# Altium project foxbms2-master.PrjPcb (part 4 of 8)

## Sheet rtc.SchDoc
size A3; DocumentNumber: 37; SheetNumber: 37; SheetTotal: 45; SheetDescription: Real Time Clock
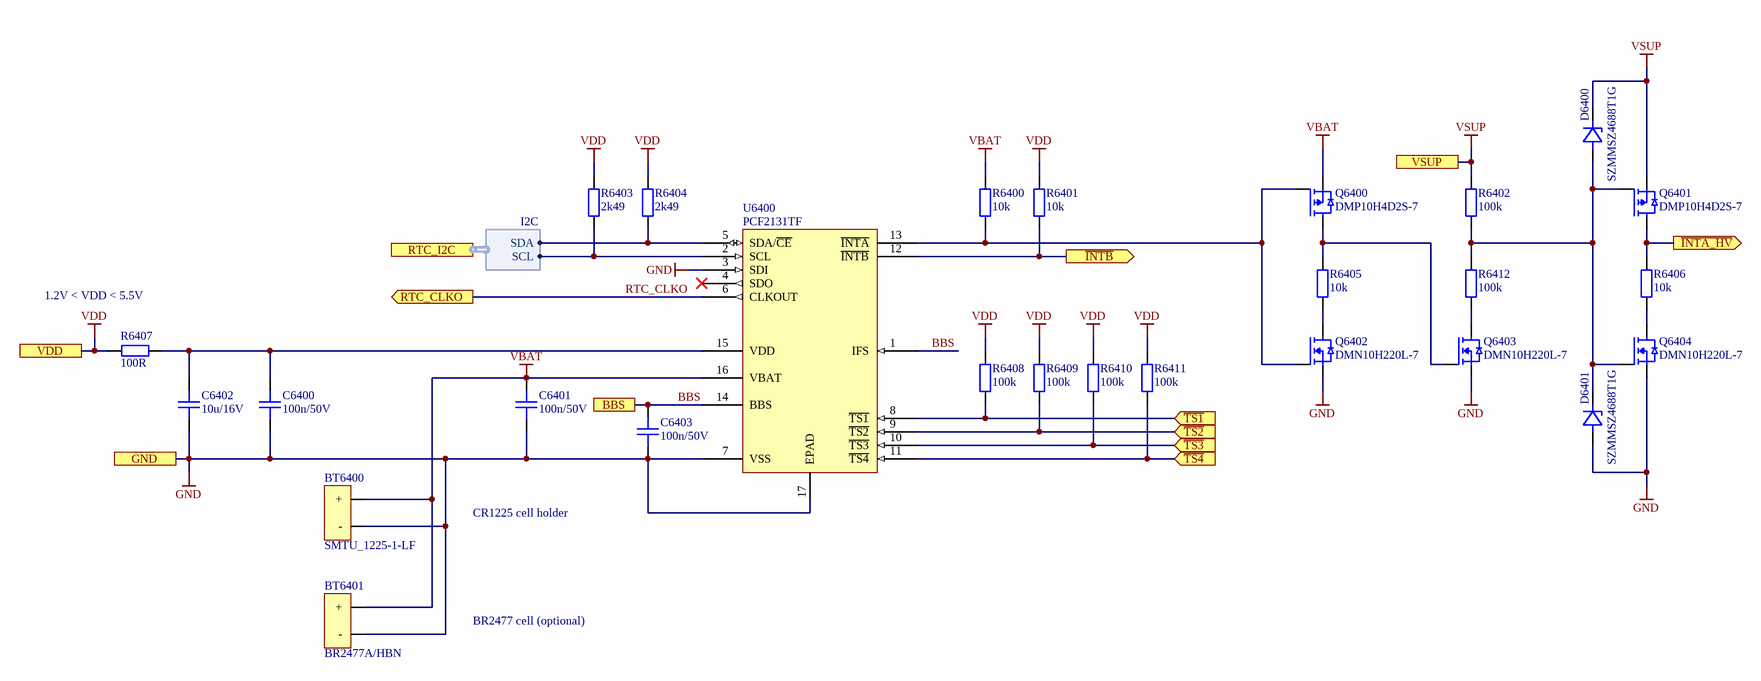
[diagram p27: rtc.SchDoc]

### Parts
BT6400  SMTU_1225-1-LF  [SMTU_1225-1-LF]
BT6401  BR2477A/HBN  [BR2477A-HBN]
C6400  100n/50V  [CAPC1005X06N]
C6401  100n/50V  [CAPC1005X06N]
C6402  10u/16V  [CAPC2012X14N]
C6403  100n/50V  [CAPC1005X06N]
D6400  SZMMSZ4688T1G  [SOD-123_CASE-425-04-ISSUE-G]
D6401  SZMMSZ4688T1G  [SOD-123_CASE-425-04-ISSUE-G]
Q6400  DMP10H4D2S-7  [SOT95P237X110-3N]
Q6401  DMP10H4D2S-7  [SOT95P237X110-3N]
Q6402  DMN10H220L-7  [SOT95P237X110-3N]
Q6403  DMN10H220L-7  [SOT95P237X110-3N]
Q6404  DMN10H220L-7  [SOT95P237X110-3N]
R6400  10k  [RESC1005X04N]
R6401  10k  [RESC1005X04N]
R6402  100k  [RESC1005X04N]
R6403  2k49  [RESC1005X04N]
R6404  2k49  [RESC1005X04N]
R6405  10k  [RESC1005X04N]
R6406  10k  [RESC1005X04N]
R6407  100R  [RESC1005X04N]
R6408  100k  [RESC1005X04N]
R6409  100k  [RESC1005X04N]
R6410  100k  [RESC1005X04N]
R6411  100k  [RESC1005X04N]
R6412  100k  [RESC1005X04N]
U6400  PCF2131TF  [NXP_SOT1992-1]

### Ports
BBS, GND, RTC_CLKO (out), RTC_I2C (harness I2C), VDD, VSUP, ~{INTA_HV} (out), ~{INTB} (out), ~{TS1} (in), ~{TS2} (in), ~{TS3} (in), ~{TS4} (in)

### Harnesses
I2C: SDA, SCL

### Nets
GND: BT6400.- BT6401.- C6400.1 C6401.1 C6402.1 C6403.1 D6401.2(A) Q6402.S Q6403.S Q6404.S U6400.3(SDI) U6400.7(VSS) U6400.17(EPAD) ; port GND
VBAT: BT6400.+ BT6401.+ C6401.2 Q6400.S R6400.2 U6400.16(VBAT)
VDD: R6401.2 R6403.2 R6404.2 R6407.2 R6408.2 R6409.2 R6410.2 R6411.2 ; port VDD  [project net MCU_3.3V]
VSUP: D6400.1(K) Q6401.S R6402.2 ; port VSUP  [project net VSUP_30]
BBS: C6403.2 U6400.1(IFS) U6400.14(BBS) ; port BBS
MCU_GIOB.1: R6401.1 U6400.12(~{INTB}) ; port ~{INTB}
MCU_GIOX.D11: R6410.1 U6400.10(~{TS3}) ; port ~{TS3}
MCU_GIOX.D12: R6409.1 U6400.9(~{TS2}) ; port ~{TS2}
MCU_GIOX.D13: R6408.1 U6400.8(~{TS1}) ; port ~{TS1}
MCU_GIOX.K16: R6411.1 U6400.11(~{TS4}) ; port ~{TS4}
MCU_I2C1.SCL: R6403.1 U6400.2(SCL) ; port RTC_I2C.SCL
MCU_I2C1.SDA: R6404.1 U6400.5(SDA/~{CE}) ; port RTC_I2C.SDA
PER_IO~{.}RTC_INTA_HV: Q6401.D R6406.2 ; port ~{INTA_HV}
RTC_CLKO: U6400.6(CLKOUT) ; port RTC_CLKO  [project net MCU_DCC.2]
NetC6400_2: C6400.2 C6402.2 R6407.1 U6400.15(VDD)
NetD6400_2: D6400.2(A) D6401.1(K) Q6401.G Q6404.G R6402.1 R6412.2
NetQ6400_D: Q6400.D Q6403.G R6405.2
NetQ6400_G: Q6400.G Q6402.G R6400.1 U6400.13(~{INTA})
NetQ6402_D: Q6402.D R6405.1
NetQ6403_D: Q6403.D R6412.1
NetQ6404_D: Q6404.D R6406.1

Not connected (* = marked no-connect by the designer): U6400 4(SDO)*

### Notes on the sheet
- (near R6407) 1.2V < VDD < 5.5V
- CR1225 cell holder
- BR2477 cell (optional)
- Fraunhofer IISB
- Schottkystr. 10
- developed by:
- 91058 Erlangen
- Germany
- Author
- Project
- License
- Description
- File
- Version
- Release Date
- Sheet
- foxbms.org <https://foxbms.org>
- www.iisb.fraunhofer.de <https://www.iisb.fraunhofer.de/>
- foxBMS Team
- /

### Library data of the parts
BT6400 = SMTU_1225-1-LF: SMTU 1225-1-LF, Battery Holder 1225; Manufacturer: Renata; Automotive Qualified: False; Part Number: SMTU_1225-1-LF; Part Name: SMTU_1225-1-LF; Operating Temperature: - / -40°C - +100°C; ComponentLink1Description: Datasheet; ComponentLink1URL: http://www.farnell.com/datasheets/1766152.pdf; Supplier 1: Farnell; Supplier Part Number 1: 1216353
BT6401 = BR2477A/HBN: Coin Cell Battery 3V 1000mAH HI TEMP; Manufacturer: Panasonic; Automotive Qualified: False; Part Number: BR2477A/HBN; Part Name: BR2477A/HBN; Operating Temperature: −40°C - +125°C; ComponentLink1Description: Datasheet; ComponentLink1URL: https://www.mouser.de/datasheet/2/315/panasonic-lithium-coin-hightemp-br2477a-datasheet-911159.pdf; Supplier 1: Digikey; Supplier Part Number 1: P029-ND; Supplier 2: Mouser; Supplier Part Number 2: 658-BR-2477A-HBN
C6400 C6401 C6403 = gen_C_ceramic_100n_50V_X7R_0402: MLCC; Capacitance: 100n; Rated Voltage: 50V; Dielectric: X7R; Case EIA: 0402; Case Metric: 1005; PnP Package: 0402C; PnP Value: 100nF/50V/X7R; PnP equipped: x; Automotive Qualified: True; AEC-Q Norm: AEC-Q200; Part Number: gen_C_ceramic_100n_50V_X7R_0402; Supplier 1: Farnell; Supplier Part Number 1: 2210822; ECCN: EAR99
C6402 = gen_C_ceramic_10u_16V_X7R_0805: MLCC; Capacitance: 10u; Rated Voltage: 16V; Dielectric: X7S; Case EIA: 0805; Case Metric: 2012; Automotive Qualified: True; AEC-Q Grade: Grade 1; AEC-Q Norm: AEC-Q200; Part Number: gen_C_ceramic_10u_16V_X7R_0805; ECCN: EAR99; Supplier 1: Digikey; Supplier Part Number 1: 445-16110-1-ND
D6400 D6401 = SZMMSZ4688T1G: Zener Diode; Manufacturer: ON Semiconductor; Breakdown Voltage: 4.7V; PnP Package: SOD123; Automotive Qualified: True; Part Number: SZMMSZ4688T1G; Part Name: SZMMSZ4688T1G; Operating Temperature: -55°C - +150°C; ComponentLink1Description: Datasheet; ComponentLink1URL: https://www.onsemi.com/pub/Collateral/MMSZ4678T1-D.PDF; Supplier 1: Digikey; Supplier Part Number 1: SZMMSZ4688T1GOSCT-ND; Supplier 2: Farnell; Supplier Part Number 2: 2774579; Supplier 3: Mouser; Supplier Part Number 3: 863-SZMMSZ4688T1G
Q6400 Q6401 = DMP10H4D2S-7: MOSFET-Transistor, p-Kanal, 0.27 A, 100 V, 4.2 ohm; Manufacturer: Diodes; Maximum Drain-Source Voltage: 100V; Maximum Continous Drain Current (25°C): 0.27A; R_DS(on): 4.2; Total Gate Charge: 1.8nC; Automotive Qualified: True; Part Number: DMP10H4D2S-7; Part Name: PMOS; Operating Temperature: -55°C - +150°C; ComponentLink1Description: Datasheet; ComponentLink1URL: https://www.diodes.com/assets/Datasheets/DMP10H4D2S.pdf; Supplier 1: Farnell; Supplier Part Number 1: 3127354; Supplier 2: Digikey; Supplier Part Number 2: DMP10H4D2S-7DICT-ND; Supplier 3: Mouser; Supplier Part Number 3: 621-DMP10H4D2S-7
Q6402-Q6404 = DMN10H220L-7: MOSFET-Transistor, n-Kanal, 1.6 A, 100 V, 0.250 ohm; Manufacturer: Diodes; Maximum Drain-Source Voltage: 100V; Maximum Continous Drain Current (25°C): 1.6A; R_DS(on): 250m; Total Gate Charge: 4.1nC; Automotive Qualified: True; Part Number: DMN10H220L-7; Part Name: NMOS; Operating Temperature: -55°C - +150°C; ComponentLink1Description: Datasheet; ComponentLink1URL: https://www.diodes.com/assets/Datasheets/DMN10H220L.pdf; Supplier 1: Digikey; Supplier Part Number 1: DMN10H220L-7DICT-ND; Supplier 2: Farnell; Supplier 3: Mouser; Supplier Part Number 2: 3127326; Supplier Part Number 3: 621-DMN10H220L-7
R6400 R6401 R6405 R6406 = gen_R_10k_0402: SMD Resistor 10k 0402; Tolerance: 1%; Power: 0.063W; Case EIA: 0402; Case Metric: 1005; Maximum Working Voltage: 50V; PnP Package: 0402R; PnP equipped: x; Automotive Qualified: True; AEC-Q Norm: AEC-Q200; Part Number: gen_R_10k_0402; Operating Temperature: -55°C - +155°C; Resistance: 10k; Series: E24, E96; PnP Value: 10k; Supplier 1: Farnell; Supplier Part Number 1: 2059239; ECCN: EAR99
R6402 R6408-R6412 = gen_R_100k_0402: SMD Resistor 100k 0402; Tolerance: 1%; Power: 0.063W; Case EIA: 0402; Case Metric: 1005; Maximum Working Voltage: 50V; PnP Package: 0402R; PnP equipped: x; Automotive Qualified: True; Part Number: gen_R_100k_0402; Operating Temperature: -55°C - +155°C; Resistance: 100k; Series: E24, E96; PnP Value: 100k; Supplier 1: Farnell; Supplier Part Number 1: 2302839
R6403 R6404 = gen_R_2k49_0402: SMD Resistor 2k49 0402; Tolerance: 1%; Power: 0.063W; Case EIA: 0402; Case Metric: 1005; Maximum Working Voltage: 50V; PnP Package: 0402R; Automotive Qualified: True; Part Number: gen_R_2k49_0402; Operating Temperature: -55°C - +155°C; Resistance: 2k49; Series: E96; PnP Value: 2k49; Supplier 1: Farnell; Supplier Part Number 1: 2059135
R6407 = gen_R_100R_0402: SMD Resistor 100R 0402; Tolerance: 1%; Power: 0.063W; Case EIA: 0402; Case Metric: 1005; Maximum Working Voltage: 50V; PnP Package: 0402R; PnP equipped: x; Automotive Qualified: True; AEC-Q Norm: AEC-Q200; Part Number: gen_R_100R_0402; Operating Temperature: -55°C - +155°C; Resistance: 100R; Series: E24, E96; PnP Value: 100R; Supplier 1: Farnell; Supplier Part Number 1: 2302528; ECCN: EAR99
U6400 = PCF2131TF: Ultra low power and high accurate RTC with integrated quartz crystal; Manufacturer: NXP; Automotive Qualified: True; AEC-Q Norm: AEC-Q100; Part Number: PCF2131TF; Part Name: PCF2131TF; Operating Temperature: −40°C - +85°C; ComponentLink1Description: Datasheet; ComponentLink1URL: https://www.nxp.com/docs/en/data-sheet/PCF2131DS.pdf

## Sheet port-expanders.SchDoc
size A3; DocumentNumber: 35; SheetNumber: 35; SheetTotal: 45; SheetDescription: Port Expanders for Digital IOs
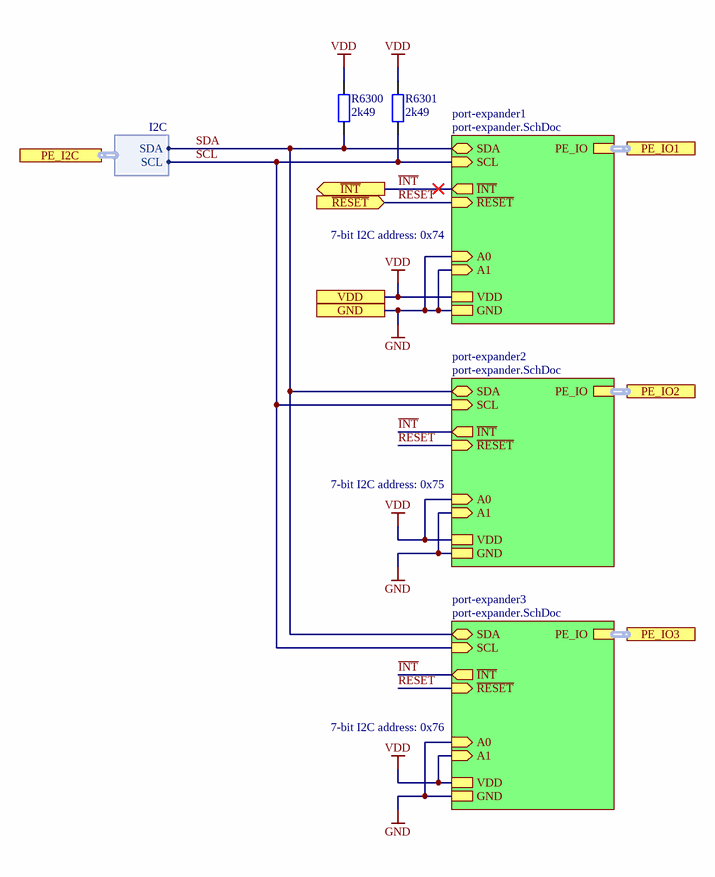
[diagram p28: port-expanders.SchDoc]

### Parts
R6300  2k49  [RESC1005X04N]
R6301  2k49  [RESC1005X04N]

### Sub-sheets
port-expander1 = port-expander.SchDoc: GND, A1 (in), A0 (in), ~{RESET} (in), VDD, SDA (bidir), ~{INT} (out), SCL (in), PE_IO (harness PE_IO)
port-expander2 = port-expander.SchDoc: GND, A1 (in), A0 (in), ~{RESET} (in), VDD, SDA (bidir), ~{INT} (out), SCL (in), PE_IO (harness PE_IO)
port-expander3 = port-expander.SchDoc: GND, A1 (in), A0 (in), ~{RESET} (in), VDD, SDA (bidir), ~{INT} (out), SCL (in), PE_IO (harness PE_IO)

### Ports
GND, PE_I2C (harness I2C), PE_IO1 (harness PE_IO), PE_IO2 (harness PE_IO), PE_IO3 (harness PE_IO), VDD, ~{INT} (out), ~{RESET} (in)

### Harnesses
I2C: SDA, SCL

### Nets
GND: port GND, sheet port-expander1/GND, sheet port-expander1/A1, sheet port-expander1/A0, sheet port-expander2/GND, sheet port-expander2/A1, sheet port-expander3/GND, sheet port-expander3/A0
VDD: R6300.2 R6301.2 ; port VDD, sheet port-expander1/VDD, sheet port-expander2/A0, sheet port-expander2/VDD, sheet port-expander3/A1, sheet port-expander3/VDD  [project net PER_3.3V]
~{INT}: port ~{INT}, sheet port-expander1/~{INT}, sheet port-expander2/~{INT}, sheet port-expander3/~{INT}  [project net MCU_GIOB.4]
~{RESET}: port ~{RESET}, sheet port-expander1/~{RESET}, sheet port-expander2/~{RESET}, sheet port-expander3/~{RESET}  [project net MCU_GIOX.M4]
SCL: R6301.1 ; sheet port-expander1/SCL, sheet port-expander2/SCL, sheet port-expander3/SCL, port PE_I2C.SCL  [project net MCU_I2C1.SCL]
SDA: R6300.1 ; sheet port-expander1/SDA, sheet port-expander2/SDA, sheet port-expander3/SDA, port PE_I2C.SDA  [project net MCU_I2C1.SDA]

### Buses and harness runs
harness port PE_IO1 = sheet port-expander1/PE_IO
harness port PE_IO2 = sheet port-expander2/PE_IO
harness port PE_IO3 = sheet port-expander3/PE_IO

### Notes on the sheet
- 7-bit I2C address: 0x74
- 7-bit I2C address: 0x75
- 7-bit I2C address: 0x76
- Fraunhofer IISB
- Schottkystr. 10
- developed by:
- 91058 Erlangen
- Germany
- Author
- Project
- License
- Description
- File
- Version
- Release Date
- Sheet
- foxbms.org <https://foxbms.org>
- www.iisb.fraunhofer.de <https://www.iisb.fraunhofer.de/>
- foxBMS Team
- /

### Library data of the parts
R6300 R6301 = gen_R_2k49_0402: as R6403 on sheet rtc; Part Number: gen_R_2k49_0402; Operating Temperature: -55°C - +155°C; Resistance: 2k49; Series: E96; PnP Value: 2k49; Supplier 1: Farnell; Supplier Part Number 1: 2059135

## Sheet port-expander.SchDoc
size A3; DocumentNumber: 36; SheetNumber: 36; SheetTotal: 45; SheetDescription: Port Expander Digital IOs
Used 3 times, as channels peripherals/port-expanders/port-expander1, peripherals/port-expanders/port-expander2, peripherals/port-expanders/port-expander3. Parts and nets are listed once, with the designators drawn on the sheet.
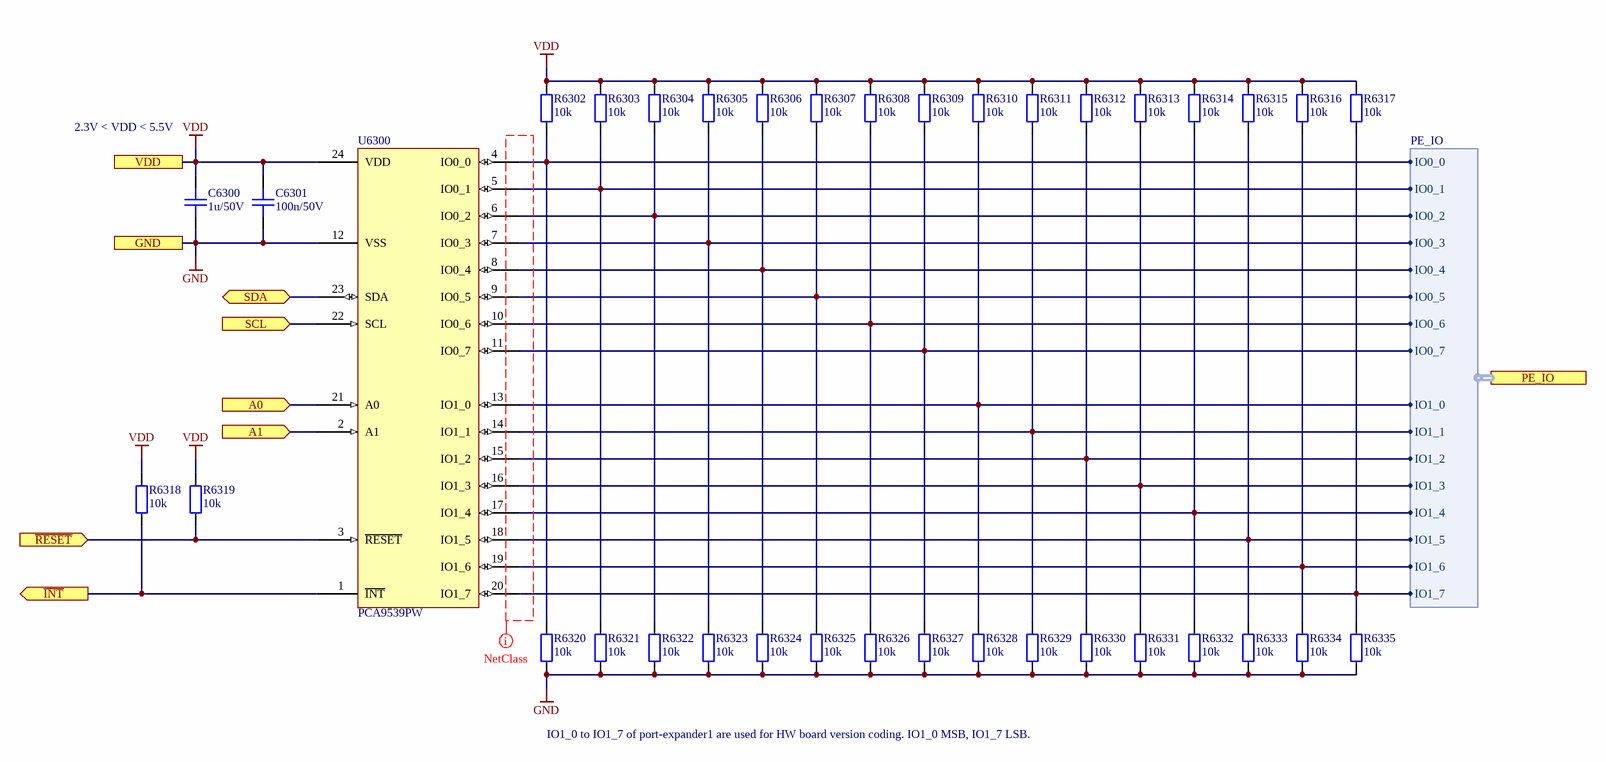
[diagram p29: port-expander.SchDoc]

### Parts
C6300  1u/50V  [CAPC1608X08N]
C6301  100n/50V  [CAPC1005X06N]
R6302  10k  [RESC1005X04N]
R6303  10k  [RESC1005X04N]
R6304  10k  [RESC1005X04N]
R6305  10k  [RESC1005X04N]
R6306  10k  [RESC1005X04N]
R6307  10k  [RESC1005X04N]
R6308  10k  [RESC1005X04N]
R6309  10k  [RESC1005X04N]
R6310  10k  [RESC1005X04N]
R6311  10k  [RESC1005X04N]
R6312  10k  [RESC1005X04N]
R6313  10k  [RESC1005X04N]
R6314  10k  [RESC1005X04N]
R6315  10k  [RESC1005X04N]
R6316  10k  [RESC1005X04N]
R6317  10k  [RESC1005X04N]
R6318  10k  [RESC1005X04N]
R6319  10k  [RESC1005X04N]
R6320  10k  [RESC1005X04N]
R6321  10k  [RESC1005X04N]
R6322  10k  [RESC1005X04N]
R6323  10k  [RESC1005X04N]
R6324  10k  [RESC1005X04N]
R6325  10k  [RESC1005X04N]
R6326  10k  [RESC1005X04N]
R6327  10k  [RESC1005X04N]
R6328  10k  [RESC1005X04N]
R6329  10k  [RESC1005X04N]
R6330  10k  [RESC1005X04N]
R6331  10k  [RESC1005X04N]
R6332  10k  [RESC1005X04N]
R6333  10k  [RESC1005X04N]
R6334  10k  [RESC1005X04N]
R6335  10k  [RESC1005X04N]
U6300  PCA9539PW  [PCA9539PW]

### Ports
A0 (in), A1 (in), GND, PE_IO (harness PE_IO), SCL (in), SDA (bidir), VDD, ~{INT} (out), ~{RESET} (in)

### Harnesses
PE_IO: IO0_0, IO0_1, IO0_2, IO0_3, IO0_4, IO0_5, IO0_6, IO0_7, IO1_0, IO1_1, IO1_2, IO1_3, IO1_4, IO1_5, IO1_6, IO1_7

### Nets
GND: C6300.1 C6301.1 R6320.1 R6321.1 R6322.1 R6323.1 R6324.1 R6325.1 R6326.1 R6327.1 R6328.1 R6329.1 R6330.1 R6331.1 R6332.1 R6333.1 R6334.1 R6335.1 U6300.12(VSS) ; port GND
VDD: C6300.2 C6301.2 R6302.2 R6303.2 R6304.2 R6305.2 R6306.2 R6307.2 R6308.2 R6309.2 R6310.2 R6311.2 R6312.2 R6313.2 R6314.2 R6315.2 R6316.2 R6317.2 R6318.2 R6319.2 U6300.24(VDD) ; port VDD
~{INT}: R6318.1 U6300.1(~{INT}) ; port ~{INT}
~{RESET}: R6319.1 U6300.3(~{RESET}) ; port ~{RESET}
A0: U6300.21(A0) ; port A0
A1: U6300.2(A1) ; port A1
SCL: U6300.22(SCL) ; port SCL
SDA: U6300.23(SDA) ; port SDA
NetR6302_1: R6302.1 R6320.2 U6300.4(IO0_0) ; port PE_IO.IO0_0
NetR6303_1: R6303.1 R6321.2 U6300.5(IO0_1) ; port PE_IO.IO0_1
NetR6304_1: R6304.1 R6322.2 U6300.6(IO0_2) ; port PE_IO.IO0_2
NetR6305_1: R6305.1 R6323.2 U6300.7(IO0_3) ; port PE_IO.IO0_3
NetR6306_1: R6306.1 R6324.2 U6300.8(IO0_4) ; port PE_IO.IO0_4
NetR6307_1: R6307.1 R6325.2 U6300.9(IO0_5) ; port PE_IO.IO0_5
NetR6308_1: R6308.1 R6326.2 U6300.10(IO0_6) ; port PE_IO.IO0_6
NetR6309_1: R6309.1 R6327.2 U6300.11(IO0_7) ; port PE_IO.IO0_7
NetR6310_1: R6310.1 R6328.2 U6300.13(IO1_0) ; port PE_IO.IO1_0
NetR6311_1: R6311.1 R6329.2 U6300.14(IO1_1) ; port PE_IO.IO1_1
NetR6312_1: R6312.1 R6330.2 U6300.15(IO1_2) ; port PE_IO.IO1_2
NetR6313_1: R6313.1 R6331.2 U6300.16(IO1_3) ; port PE_IO.IO1_3
NetR6314_1: R6314.1 R6332.2 U6300.17(IO1_4) ; port PE_IO.IO1_4
NetR6315_1: R6315.1 R6333.2 U6300.18(IO1_5) ; port PE_IO.IO1_5
NetR6316_1: R6316.1 R6334.2 U6300.19(IO1_6) ; port PE_IO.IO1_6
NetR6317_1: R6317.1 R6335.2 U6300.20(IO1_7) ; port PE_IO.IO1_7

### Channels
peripherals/port-expanders/port-expander1: designators end in _1; ports A0=GND A1=GND GND=GND SCL=MCU_I2C1.SCL SDA=MCU_I2C1.SDA VDD=PER_3.3V ~{INT}=MCU_GIOB.4 ~{RESET}=MCU_GIOX.M4
peripherals/port-expanders/port-expander2: designators end in _2; ports A0=PER_3.3V A1=GND GND=GND SCL=MCU_I2C1.SCL SDA=MCU_I2C1.SDA VDD=PER_3.3V ~{INT}=MCU_GIOB.4 ~{RESET}=MCU_GIOX.M4
peripherals/port-expanders/port-expander3: designators end in _3; ports A0=GND A1=PER_3.3V GND=GND SCL=MCU_I2C1.SCL SDA=MCU_I2C1.SDA VDD=PER_3.3V ~{INT}=MCU_GIOB.4 ~{RESET}=MCU_GIOX.M4

### Layout directives
net class PE_IO: (no net found under the mark)

### Notes on the sheet
- 2.3V < VDD < 5.5V
- IO1_0 to IO1_7 of port-expander1 are used for HW board version coding. IO1_0 MSB, IO1_7 LSB.
- Fraunhofer IISB
- Schottkystr. 10
- developed by:
- 91058 Erlangen
- Germany
- Author
- Project
- License
- Description
- File
- Version
- Release Date
- Sheet
- foxbms.org <https://foxbms.org>
- www.iisb.fraunhofer.de <https://www.iisb.fraunhofer.de/>
- foxBMS Team
- /

### Library data of the parts
C6300 = gen_C_ceramic_1u_50V_X7R_0603: MLCC; Capacitance: 1u; Rated Voltage: 50V; Dielectric: X7R; Case EIA: 0603; Case Metric: 1608; Automotive Qualified: False; Tolerance: ± 10%; PnP Package: 0603C; Part Number: gen_C_ceramic_1u_50V_X7R_0603; Operating Temperature: -55°C - +125°C; Supplier 1: Farnell; Supplier Part Number 1: 2779055
C6301 = gen_C_ceramic_100n_50V_X7R_0402: as C6400 on sheet rtc; Part Number: gen_C_ceramic_100n_50V_X7R_0402; Supplier 1: Farnell; Supplier Part Number 1: 2210822; ECCN: EAR99
R6302-R6335 = gen_R_10k_0402: as R6400 on sheet rtc; Part Number: gen_R_10k_0402; Operating Temperature: -55°C - +155°C; Resistance: 10k; Series: E24, E96; PnP Value: 10k; Supplier 1: Farnell; Supplier Part Number 1: 2059239; ECCN: EAR99
U6300 = PCA9539PW: 16-bit I2C-bus and SMBus low power I/O port with interrupt and reset; Manufacturer: NXP; Automotive Qualified: False; Part Number: PCA9539PW; Part Name: PCA9539PW; Operating Temperature: −40°C - +125°C; ComponentLink1Description: Datasheet; ComponentLink1URL: https://www.nxp.com/docs/en/data-sheet/PCA9539_PCA9539R.pdf; Supplier 1: Mouser; Supplier Part Number 1: 771-PCA9539PW/Q90011

## Sheet voltage-reference-5.0V.SchDoc
size A3; DocumentNumber: 39; SheetNumber: 39; SheetTotal: 45; SheetDescription: 5.0V reference voltage
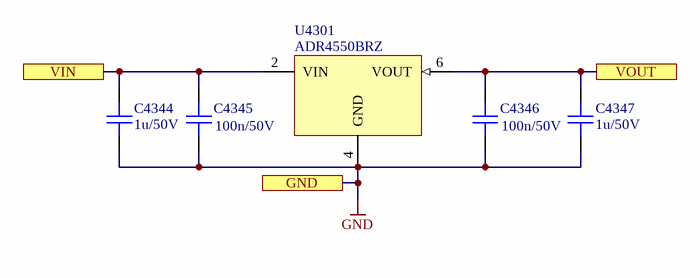
[diagram p30: voltage-reference-5.0V.SchDoc]

### Parts
C4344  1u/50V  [CAPC1608X08N]
C4345  100n/50V  [CAPC1005X06N]
C4346  100n/50V  [CAPC1005X06N]
C4347  1u/50V  [CAPC1608X08N]
U4301  ADR4550BRZ  [SOIC127P600X175-8N]

### Ports
GND, VIN, VOUT

### Nets
GND: C4344.1 C4345.1 C4346.1 C4347.1 U4301.4(GND) ; port GND
PER_5.74V: C4344.2 C4345.2 U4301.2(VIN) ; port VIN
VREF_5V: C4346.2 C4347.2 U4301.6(VOUT) ; port VOUT

### Notes on the sheet
- Fraunhofer IISB
- Schottkystr. 10
- developed by:
- 91058 Erlangen
- Germany
- Author
- Project
- License
- Description
- File
- Version
- Release Date
- Sheet
- foxbms.org <https://foxbms.org>
- www.iisb.fraunhofer.de <https://www.iisb.fraunhofer.de/>
- foxBMS Team
- /

### Library data of the parts
C4344 C4347 = gen_C_ceramic_1u_50V_X7R_0603: MLCC; Capacitance: 1u; Rated Voltage: 50V; Dielectric: X7R; Tolerance: ± 10%; Case EIA: 0603; Case Metric: 1608; Automotive Qualified: False; PnP Package: 0603C; Part Number: gen_C_ceramic_1u_50V_X7R_0603; Operating Temperature: -55°C - +125°C; Supplier 1: Farnell; Supplier Part Number 1: 2779055
C4345 C4346 = gen_C_ceramic_100n_50V_X7R_0402: as C6400 on sheet rtc; Part Number: gen_C_ceramic_100n_50V_X7R_0402; Supplier 1: Farnell; Supplier Part Number 1: 2210822; ECCN: EAR99
U4301 = ADR4550BRZ: Ultralow Noise, High Accuracy Voltage Reference; Manufacturer: Analog Devices; PnP Package: SO-8; Automotive Qualified: True; AEC-Q Grade: unknown; AEC-Q Norm: AEC-Q100; Part Number: ADR4550BRZ; Part Name: ADR4550BRZ; Operating Temperature: −40°C - +125°C; ComponentLink1Description: Datasheet; ComponentLink1URL: http://www.analog.com/media/en/technical-documentation/data-sheets/ADR4520_4525_4530_4533_4540_4550.pdf; Supplier 1: Farnell; Supplier Part Number 1: 2112695; Supplier 2: Digikey; Supplier Part Number 2: ADR4550BRZ-ND; Supplier 3: Mouser; Supplier Part Number 3: 584-ADR4550BRZ; ECCN: EAR99

## Sheet io-devices.SchDoc
size A3; DocumentNumber: 15; SheetNumber: 15; SheetTotal: 45; SheetDescription: Smart Switches, Isolation Monitoring
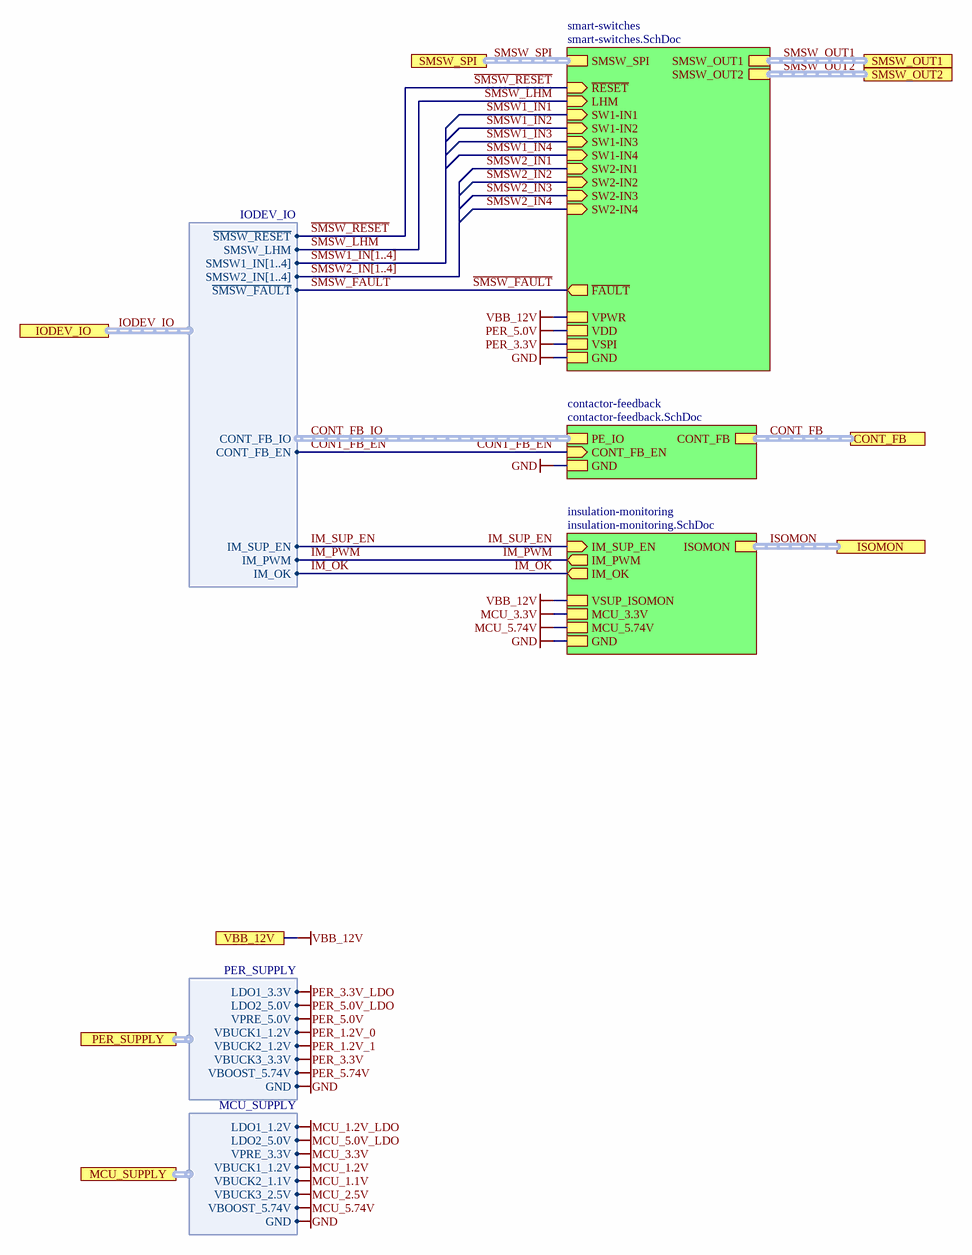
[diagram p31: io-devices.SchDoc]

### Sub-sheets
contactor-feedback = contactor-feedback.SchDoc: PE_IO (harness PE_IO), CONT_FB (harness PE_IO), GND, CONT_FB_EN (in)
insulation-monitoring = insulation-monitoring.SchDoc: GND, IM_SUP_EN (in), ISOMON (harness ISOMON), VSUP_ISOMON, IM_PWM (out), IM_OK (out), MCU_3.3V, MCU_5.74V
smart-switches = smart-switches.SchDoc: ~{RESET} (in), LHM (in), ~{FAULT} (out), SMSW_SPI (harness SPI), SMSW_OUT2 (harness SMSW_OUT), SMSW_OUT1 (harness SMSW_OUT), SW1-IN4 (in), SW2-IN2 (in), SW1-IN1 (in), SW2-IN3 (in), SW1-IN3 (in), SW1-IN2 (in), SW2-IN4 (in), SW2-IN1 (in), GND, VDD, VPWR, VSPI

### Ports
CONT_FB (harness PE_IO), IODEV_IO (harness IODEV_IO), ISOMON (harness ISOMON), MCU_SUPPLY (harness MCU_SUPPLY), PER_SUPPLY (harness PER_SUPPLY), SMSW_OUT1 (harness SMSW_OUT), SMSW_OUT2 (harness SMSW_OUT), SMSW_SPI (harness SPI), VBB_12V

### Harnesses
IODEV_IO: ~{SMSW_RESET}, SMSW_LHM, ~{SMSW_FAULT}, CONT_FB_IO, CONT_FB_EN, IM_SUP_EN, IM_PWM, IM_OK, SMSW1_IN[1..4], SMSW2_IN[1..4]
PER_SUPPLY: GND, VBOOST_5.74V, LDO1_3.3V, LDO2_5.0V, VPRE_5.0V, VBUCK1_1.2V, VBUCK2_1.2V, VBUCK3_3.3V
MCU_SUPPLY: VBUCK1_1.2V, VBUCK2_1.1V, VBUCK3_2.5V, LDO1_1.2V, LDO2_5.0V, GND, VPRE_3.3V, VBOOST_5.74V

### Nets
GND: sheet smart-switches/GND, sheet contactor-feedback/GND, sheet insulation-monitoring/GND, port PER_SUPPLY.GND, port MCU_SUPPLY.GND
MCU_3.3V: sheet insulation-monitoring/MCU_3.3V, port MCU_SUPPLY.VPRE_3.3V
MCU_5.74V: sheet insulation-monitoring/MCU_5.74V, port MCU_SUPPLY.VBOOST_5.74V
PER_3.3V: sheet smart-switches/VSPI, port PER_SUPPLY.VBUCK3_3.3V
PER_5.0V: sheet smart-switches/VDD, port PER_SUPPLY.VPRE_5.0V
VBB_12V: port VBB_12V, sheet smart-switches/VPWR, sheet insulation-monitoring/VSUP_ISOMON
~{SMSW_FAULT}: sheet smart-switches/~{FAULT}, port IODEV_IO.~{SMSW_FAULT}  [project net IODEV_IO~{.}SMSW_FAULT]
~{SMSW_RESET}: sheet smart-switches/~{RESET}, port IODEV_IO.~{SMSW_RESET}  [project net IODEV_IO~{.}SMSW_RESET]
CONT_FB_EN: sheet contactor-feedback/CONT_FB_EN, port IODEV_IO.CONT_FB_EN  [project net IODEV_IO.CONT_FB_EN]
IM_OK: sheet insulation-monitoring/IM_OK, port IODEV_IO.IM_OK  [project net IODEV_IO.IM_OK]
IM_PWM: sheet insulation-monitoring/IM_PWM, port IODEV_IO.IM_PWM  [project net IODEV_IO.IM_PWM]
IM_SUP_EN: sheet insulation-monitoring/IM_SUP_EN, port IODEV_IO.IM_SUP_EN  [project net IODEV_IO.IM_SUP_EN]
SMSW_LHM: sheet smart-switches/LHM, port IODEV_IO.SMSW_LHM  [project net EXT_CON.SMSW_LHM]

### Buses and harness runs
bus SMSW1_IN[1..4]
bus SMSW2_IN[1..4]
harness CONT_FB = port CONT_FB = sheet contactor-feedback/CONT_FB
harness CONT_FB_IO = sheet contactor-feedback/PE_IO
harness IODEV_IO = port IODEV_IO
harness ISOMON = port ISOMON = sheet insulation-monitoring/ISOMON
harness SMSW_OUT1 = port SMSW_OUT1 = sheet smart-switches/SMSW_OUT1
harness SMSW_OUT2 = port SMSW_OUT2 = sheet smart-switches/SMSW_OUT2
harness SMSW_SPI = port SMSW_SPI = sheet smart-switches/SMSW_SPI

### Notes on the sheet
- Fraunhofer IISB
- Schottkystr. 10
- developed by:
- 91058 Erlangen
- Germany
- Author
- Project
- License
- Description
- File
- Version
- Release Date
- Sheet
- foxbms.org <https://foxbms.org>
- www.iisb.fraunhofer.de <https://www.iisb.fraunhofer.de/>
- foxBMS Team
- /

## Sheet smart-switches.SchDoc
size A3; DocumentNumber: 19; SheetNumber: 19; SheetTotal: 45; SheetDescription: Smart High-Side Switches
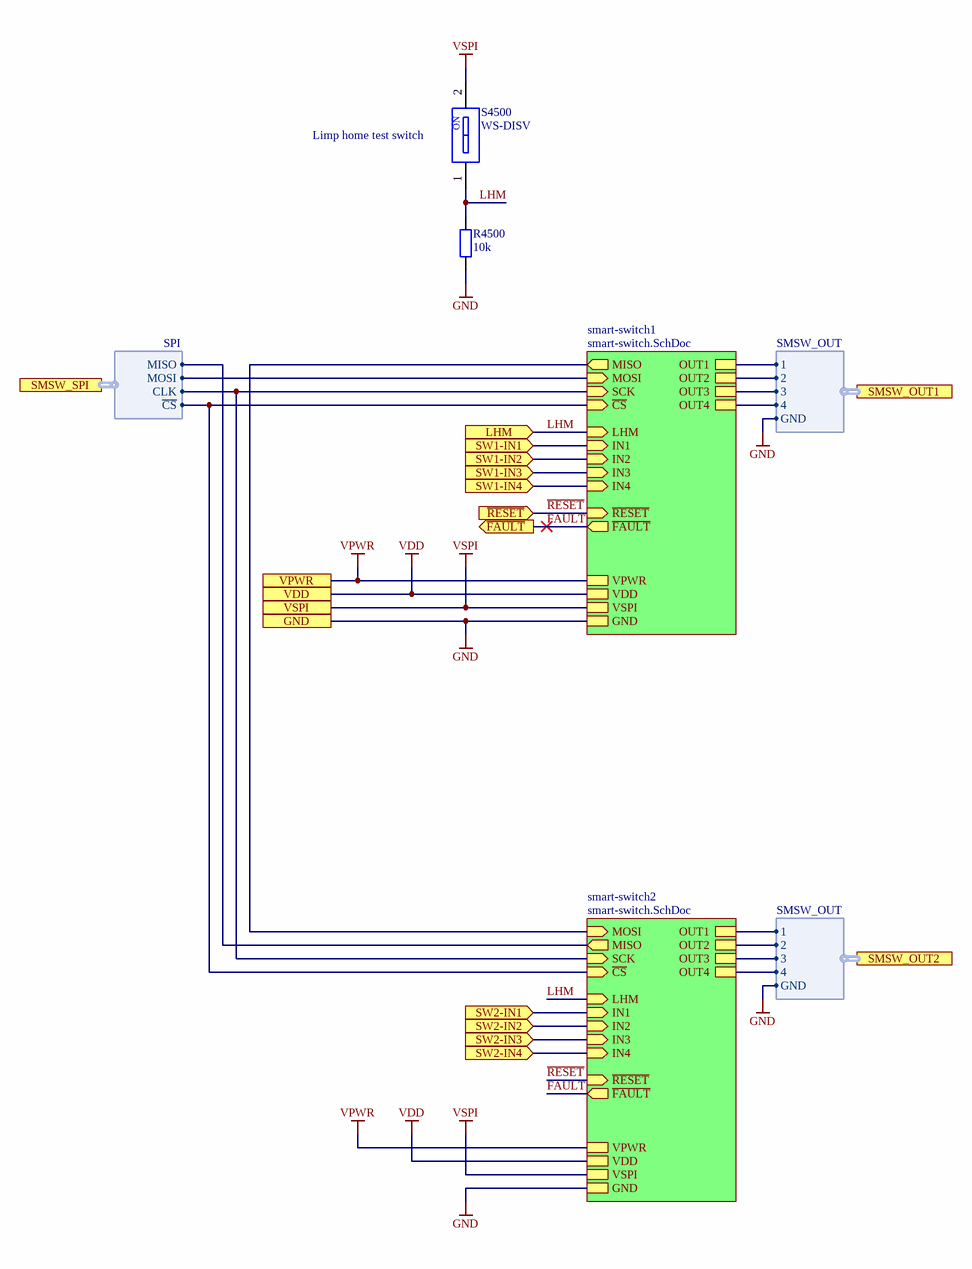
[diagram p32: smart-switches.SchDoc]

### Parts
R4500  10k  [RESC1005X04N]
S4500  WS-DISV  [WE_416131160801]

### Sub-sheets
smart-switch1 = smart-switch.SchDoc: SCK (in), ~{CS} (in), OUT2, MISO (out), OUT1, OUT3, OUT4, LHM (in), MOSI (in), ~{RESET} (in), GND, VSPI, VPWR, ~{FAULT} (out), VDD, IN2 (in), IN3 (in), IN1 (in), IN4 (in)
smart-switch2 = smart-switch.SchDoc: SCK (in), ~{CS} (in), OUT2, MISO (out), OUT1, OUT3, OUT4, LHM (in), MOSI (in), ~{RESET} (in), GND, VSPI, VPWR, ~{FAULT} (out), VDD, IN4 (in), IN3 (in), IN2 (in), IN1 (in)

### Ports
GND, LHM (in), SMSW_OUT1 (harness SMSW_OUT), SMSW_OUT2 (harness SMSW_OUT), SMSW_SPI (harness SPI), SW1-IN1 (in), SW1-IN2 (in), SW1-IN3 (in), SW1-IN4 (in), SW2-IN1 (in), SW2-IN2 (in), SW2-IN3 (in), SW2-IN4 (in), VDD, VPWR, VSPI, ~{FAULT} (out), ~{RESET} (in)

### Harnesses
SMSW_OUT: 1, 2, 3, 4, GND
SPI: CLK, MOSI, MISO, ~{CS}

### Nets
GND: R4500.1 ; port GND, sheet smart-switch1/GND, sheet smart-switch2/GND, port SMSW_OUT1.GND, port SMSW_OUT2.GND
VDD: port VDD, sheet smart-switch1/VDD, sheet smart-switch2/VDD  [project net PER_5.0V]
VPWR: port VPWR, sheet smart-switch1/VPWR, sheet smart-switch2/VPWR  [project net VBB_12V]
VSPI: S4500.2 ; port VSPI, sheet smart-switch1/VSPI, sheet smart-switch2/VSPI  [project net PER_3.3V]
~{FAULT}: port ~{FAULT}, sheet smart-switch1/~{FAULT}, sheet smart-switch2/~{FAULT}  [project net IODEV_IO~{.}SMSW_FAULT]
~{RESET}: port ~{RESET}, sheet smart-switch1/~{RESET}, sheet smart-switch2/~{RESET}  [project net IODEV_IO~{.}SMSW_RESET]
LHM: R4500.2 S4500.1 ; port LHM, sheet smart-switch1/LHM, sheet smart-switch2/LHM  [project net EXT_CON.SMSW_LHM]
MCU_SPI2~{.}sCS2: sheet smart-switch1/~{CS}, sheet smart-switch2/~{CS}, port SMSW_SPI.~{CS}
MCU_SPI2.CLK: sheet smart-switch1/SCK, sheet smart-switch2/SCK, port SMSW_SPI.CLK
MCU_SPI2.SIMO: sheet smart-switch1/MOSI, port SMSW_SPI.MOSI
MCU_SPI2.SOMI: sheet smart-switch2/MISO, port SMSW_SPI.MISO
SMSW1_IN1: port SW1-IN1, sheet smart-switch1/IN1
SMSW1_IN2: port SW1-IN2, sheet smart-switch1/IN2
SMSW1_IN3: port SW1-IN3, sheet smart-switch1/IN3
SMSW1_IN4: port SW1-IN4, sheet smart-switch1/IN4
SMSW2_IN1: port SW2-IN1, sheet smart-switch2/IN1
SMSW2_IN2: port SW2-IN2, sheet smart-switch2/IN2
SMSW2_IN3: port SW2-IN3, sheet smart-switch2/IN3
SMSW2_IN4: port SW2-IN4, sheet smart-switch2/IN4
SMSW_OUT1.1: sheet smart-switch1/OUT1, port SMSW_OUT1.1
SMSW_OUT1.2: sheet smart-switch1/OUT2, port SMSW_OUT1.2
SMSW_OUT1.3: sheet smart-switch1/OUT3, port SMSW_OUT1.3
SMSW_OUT1.4: sheet smart-switch1/OUT4, port SMSW_OUT1.4
SMSW_OUT2.1: sheet smart-switch2/OUT1, port SMSW_OUT2.1
SMSW_OUT2.2: sheet smart-switch2/OUT2, port SMSW_OUT2.2
SMSW_OUT2.3: sheet smart-switch2/OUT3, port SMSW_OUT2.3
SMSW_OUT2.4: sheet smart-switch2/OUT4, port SMSW_OUT2.4
NetU4500_1_9: sheet smart-switch1/MISO, sheet smart-switch2/MOSI

### Notes on the sheet
- (near S4500) Limp home test switch
- Fraunhofer IISB
- Schottkystr. 10
- developed by:
- 91058 Erlangen
- Germany
- Author
- Project
- License
- Description
- File
- Version
- Release Date
- Sheet
- foxbms.org <https://foxbms.org>
- www.iisb.fraunhofer.de <https://www.iisb.fraunhofer.de/>
- foxBMS Team
- /
- (in symbol WE_416131160801) ON

### Library data of the parts
R4500 = gen_R_10k_0402: SMD Resistor 10k 0402; Tolerance: 1%; Power: 0.063W; Case EIA: 0402; Case Metric: 1005; Maximum Working Voltage: 50V; PnP Package: 0402R; Automotive Qualified: True; PnP equipped: x; AEC-Q Norm: AEC-Q200; Part Number: gen_R_10k_0402; Operating Temperature: -55°C - +155°C; Resistance: 10k; Series: E24, E96; PnP Value: 10k; Supplier 1: Farnell; Supplier Part Number 1: 2059239; ECCN: EAR99
S4500 = WE_416131160801: WS-DISV Small Compact SMT DipSwitch; Manufacturer: Würth Elektronik; Automotive Qualified: False; Part Number: WE_416131160801; Part Name: WS-DISV; Operating Temperature: -40°C - +85°C; ComponentLink1Description: Datasheet; ComponentLink1URL: https://www.we-online.de/katalog/datasheet/418121270801.pdf; Supplier 1: Digikey; Supplier Part Number 1: 732-3851-1-ND; Supplier 2: Mouser; Supplier Part Number 2: 710-416131160801

## Sheet smart-switch.SchDoc
size A3; DocumentNumber: 20; SheetNumber: 20; SheetTotal: 45; SheetDescription: Smart high-side switch
Used 2 times, as channels io-devices/smart-switches/smart-switch1, io-devices/smart-switches/smart-switch2. Parts and nets are listed once, with the designators drawn on the sheet.
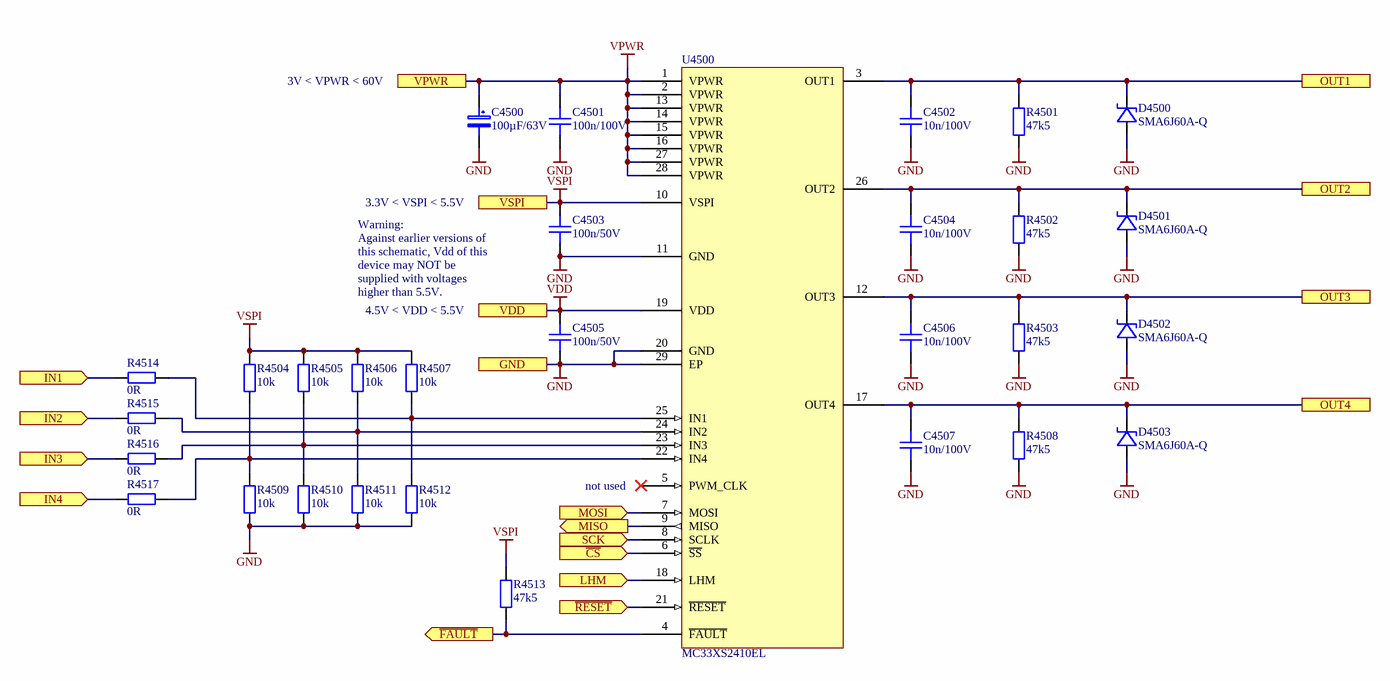
[diagram p33: smart-switch.SchDoc]

### Parts
C4500  100µF/63V  [ELECTROLYTIC_CAP_PANASONIC_G]
C4501  100n/100V  [CAPC1608X08N]
C4502  10n/100V  [CAPC1608X08N]
C4503  100n/50V  [CAPC1005X06N]
C4504  10n/100V  [CAPC1608X08N]
C4505  100n/50V  [CAPC1005X06N]
C4506  10n/100V  [CAPC1608X08N]
C4507  10n/100V  [CAPC1608X08N]
D4500  SMA6J60A-Q  [BOURNS_DO-214AC_SMA]
D4501  SMA6J60A-Q  [BOURNS_DO-214AC_SMA]
D4502  SMA6J60A-Q  [BOURNS_DO-214AC_SMA]
D4503  SMA6J60A-Q  [BOURNS_DO-214AC_SMA]
R4501  47k5  [RESC1005X04N]
R4502  47k5  [RESC1005X04N]
R4503  47k5  [RESC1005X04N]
R4504  10k  [RESC1005X04N]
R4505  10k  [RESC1005X04N]
R4506  10k  [RESC1005X04N]
R4507  10k  [RESC1005X04N]
R4508  47k5  [RESC1005X04N]
R4509  10k  [RESC1005X04N]
R4510  10k  [RESC1005X04N]
R4511  10k  [RESC1005X04N]
R4512  10k  [RESC1005X04N]
R4513  47k5  [RESC1005X04N]
R4514  0R  [RESC1005X04N]
R4515  0R  [RESC1005X04N]
R4516  0R  [RESC1005X04N]
R4517  0R  [RESC1005X04N]
U4500  MC33XS2410EL  [MC33XS2410EL]

### Ports
GND, IN1 (in), IN2 (in), IN3 (in), IN4 (in), LHM (in), MISO (out), MOSI (in), OUT1, OUT2, OUT3, OUT4, SCK (in), VDD, VPWR, VSPI, ~{CS} (in), ~{FAULT} (out), ~{RESET} (in)

### Nets
GND: C4500.2 C4501.1 C4502.1 C4503.1 C4504.1 C4505.1 C4506.1 C4507.1 D4500.2(A) D4501.2(A) D4502.2(A) D4503.2(A) R4501.1 R4502.1 R4503.1 R4508.1 R4509.1 R4510.1 R4511.1 R4512.1 U4500.11(GND) U4500.20(GND) U4500.29(EP) ; port GND
VDD: C4505.2 U4500.19(VDD) ; port VDD
VPWR: C4500.1 C4501.2 U4500.1(VPWR) U4500.2(VPWR) U4500.13(VPWR) U4500.14(VPWR) U4500.15(VPWR) U4500.16(VPWR) U4500.27(VPWR) U4500.28(VPWR) ; port VPWR
VSPI: C4503.2 R4504.2 R4505.2 R4506.2 R4507.2 R4513.2 U4500.10(VSPI) ; port VSPI
~{CS}: U4500.6(~{SS}) ; port ~{CS}
~{FAULT}: R4513.1 U4500.4(~{FAULT}) ; port ~{FAULT}
~{RESET}: U4500.21(~{RESET}) ; port ~{RESET}
IN1: R4514.1 ; port IN1
IN2: R4515.1 ; port IN2
IN3: R4516.1 ; port IN3
IN4: R4517.1 ; port IN4
LHM: U4500.18(LHM) ; port LHM
MISO: U4500.9(MISO) ; port MISO
MOSI: U4500.7(MOSI) ; port MOSI
OUT1: C4502.2 D4500.1(C) R4501.2 U4500.3(OUT1) ; port OUT1
OUT2: C4504.2 D4501.1(C) R4502.2 U4500.26(OUT2) ; port OUT2
OUT3: C4506.2 D4502.1(C) R4503.2 U4500.12(OUT3) ; port OUT3
OUT4: C4507.2 D4503.1(C) R4508.2 U4500.17(OUT4) ; port OUT4
SCK: U4500.8(SCLK) ; port SCK
NetR4504_1: R4504.1 R4509.2 R4517.2 U4500.22(IN4)
NetR4505_1: R4505.1 R4510.2 R4516.2 U4500.23(IN3)
NetR4506_1: R4506.1 R4511.2 R4515.2 U4500.24(IN2)
NetR4507_1: R4507.1 R4512.2 R4514.2 U4500.25(IN1)

Not connected (* = marked no-connect by the designer): U4500 5(PWM_CLK)*

### Channels
io-devices/smart-switches/smart-switch1: designators end in _1; ports GND=GND IN1=SMSW1_IN1 IN2=SMSW1_IN2 IN3=SMSW1_IN3 IN4=SMSW1_IN4 LHM=EXT_CON.SMSW_LHM MISO=NetU4500_1_9 MOSI=MCU_SPI2.SIMO OUT1=SMSW_OUT1.1 OUT2=SMSW_OUT1.2 OUT3=SMSW_OUT1.3 OUT4=SMSW_OUT1.4 SCK=MCU_SPI2.CLK VDD=PER_5.0V VPWR=VBB_12V VSPI=PER_3.3V ~{CS}=MCU_SPI2~{.}sCS2 ~{FAULT}=IODEV_IO~{.}SMSW_FAULT ~{RESET}=IODEV_IO~{.}SMSW_RESET
io-devices/smart-switches/smart-switch2: designators end in _2; ports GND=GND IN1=SMSW2_IN1 IN2=SMSW2_IN2 IN3=SMSW2_IN3 IN4=SMSW2_IN4 LHM=EXT_CON.SMSW_LHM MISO=MCU_SPI2.SOMI MOSI=NetU4500_1_9 OUT1=SMSW_OUT2.1 OUT2=SMSW_OUT2.2 OUT3=SMSW_OUT2.3 OUT4=SMSW_OUT2.4 SCK=MCU_SPI2.CLK VDD=PER_5.0V VPWR=VBB_12V VSPI=PER_3.3V ~{CS}=MCU_SPI2~{.}sCS2 ~{FAULT}=IODEV_IO~{.}SMSW_FAULT ~{RESET}=IODEV_IO~{.}SMSW_RESET

### Notes on the sheet
- 3V < VPWR < 60V
- 3.3V < VSPI < 5.5V
- Warning:
  Against earlier versions of this schematic, Vdd of this device may NOT be supplied with voltages higher than 5.5V.
- 4.5V < VDD < 5.5V
- not used
- Fraunhofer IISB
- Schottkystr. 10
- developed by:
- 91058 Erlangen
- Germany
- Author
- Project
- License
- Description
- File
- Version
- Release Date
- Sheet
- foxbms.org <https://foxbms.org>
- www.iisb.fraunhofer.de <https://www.iisb.fraunhofer.de/>
- foxBMS Team
- /

### Library data of the parts
C4500 = EEE-TG1J101UP: SMD Electrolytic Capacitor; Capacitance: 100µF; Rated Voltage: 63V; Tolerance: +-20%; Heigth: 10.5mm; Automotive Qualified: True; Part Number: EEE-TG1J101UP; Operating Temperature: -40°C to 125°C; Diameter: 10mm; ComponentLink1Description: Datasheet; ComponentLink1URL: https://industrial.panasonic.com/cdbs/www-data/pdf/RDE0000/ABA0000C1187.pdf; Supplier 1: Digikey; Supplier Part Number 1: PCE4086CT-ND
C4501 = gen_C_ceramic_100n_100V_X7R_0603: MLCC; Capacitance: 100n; Rated Voltage: 100V; Dielectric: X7R; Case EIA: 0603; Case Metric: 1608; Automotive Qualified: True; PnP Package: 0603C; Part Number: gen_C_ceramic_100n_100V_X7R_0603; Supplier 1: Digikey; Supplier Part Number 1: 490-13420-1-ND; Supplier 2: Mouser; Supplier Part Number 2: 81-GCJ188R72A104KA1D
C4502 C4504 C4506 C4507 = gen_C_ceramic_10n_100V_X7R_0603: MLCC; Capacitance: 10n; Rated Voltage: 100V; Dielectric: X7R; Case EIA: 0603; Case Metric: 1608; PnP Package: 0603C; PnP Value: 10nF/100V/X7R; Automotive Qualified: True; AEC-Q Norm: AEC-Q200; Part Number: gen_C_ceramic_10n_100V_X7R_0603; Supplier 1: Farnell; Supplier Part Number 1: 1301715; Supplier 2: Farnell; Supplier Part Number 2: 2821192; Supplier 3: Farnell; Supplier Part Number 3: 2210878; ECCN: EAR99
C4503 C4505 = gen_C_ceramic_100n_50V_X7R_0402: as C6400 on sheet rtc; Part Number: gen_C_ceramic_100n_50V_X7R_0402; Supplier 1: Farnell; Supplier Part Number 1: 2210822; ECCN: EAR99
D4500-D4503 = SMA6J60A-Q: TVS-Diode DO-214AC (SMA); Manufacturer: Bourns; Breakdown Voltage: 60V; Automotive Qualified: True; AEC-Q Norm: AEC-Q101; AEC-Q Grade: Grade 0; Part Number: SMA6J60A-Q; Part Name: SMA6J60A-Q; Operating Temperature: -55°C - +150°C; ComponentLink1Description: Datasheet; ComponentLink1URL: https://www.mouser.de/datasheet/2/54/sma6j_q-1919913.pdf; Supplier 1: Mouser; Supplier Part Number 1: 652-SMA6J60A-Q; ECCN: EAR99
R4501-R4503 R4508 R4513 = gen_R_47k5_0402: SMD Resistor 47k5 0402; Tolerance: 1%; Power: 0.063W; Case EIA: 0402; Case Metric: 1005; Maximum Working Voltage: 50V; PnP Package: 0402R; Automotive Qualified: True; AEC-Q Grade: Grade 0; AEC-Q Norm: AEC-Q200; Part Number: gen_R_47k5_0402; Operating Temperature: -55°C - +155°C; Resistance: 47k5; Series: E96; PnP Value: 47k5; ECCN: EAR99; Supplier 1: Farnell; Supplier Part Number 1: 2563598
R4504-R4507 R4509-R4512 = gen_R_10k_0402: as R6400 on sheet rtc; Part Number: gen_R_10k_0402; Operating Temperature: -55°C - +155°C; Resistance: 10k; Series: E24, E96; PnP Value: 10k; Supplier 1: Farnell; Supplier Part Number 1: 2059239; ECCN: EAR99
R4514-R4517 = gen_R_0R_0402: SMD Resistor 0R 0402; Power: 0.063W; Case EIA: 0402; Case Metric: 1005; Maximum Working Voltage: 50V; PnP Package: 0402R; Automotive Qualified: True; AEC-Q Norm: AEC-Q200; PnP equipped: x; Part Number: gen_R_0R_0402; Operating Temperature: -55°C - +155°C; Resistance: 0R; Series: Jumper; PnP Value: 0R; Supplier 1: Farnell; Supplier Part Number 1: 1469661; Supplier 2: Farnell; Supplier Part Number 2: 2059190; ECCN: EAR99
U4500 = MC33XS2410EL: Quad 100 mΩ / dual 50 mΩ, 3.0 V to 60 V high-side switch; Manufacturer: NXP; PnP Package: HTSSOP-28; Automotive Qualified: True; Part Number: MC33XS2410EL; Part Name: MC33XS2410EL; Operating Temperature: −40°C - +125°C

## Sheet contactor-feedback.SchDoc
size A3; DocumentNumber: 16; SheetNumber: 16; SheetTotal: 45; SheetDescription: Contactor Feedback
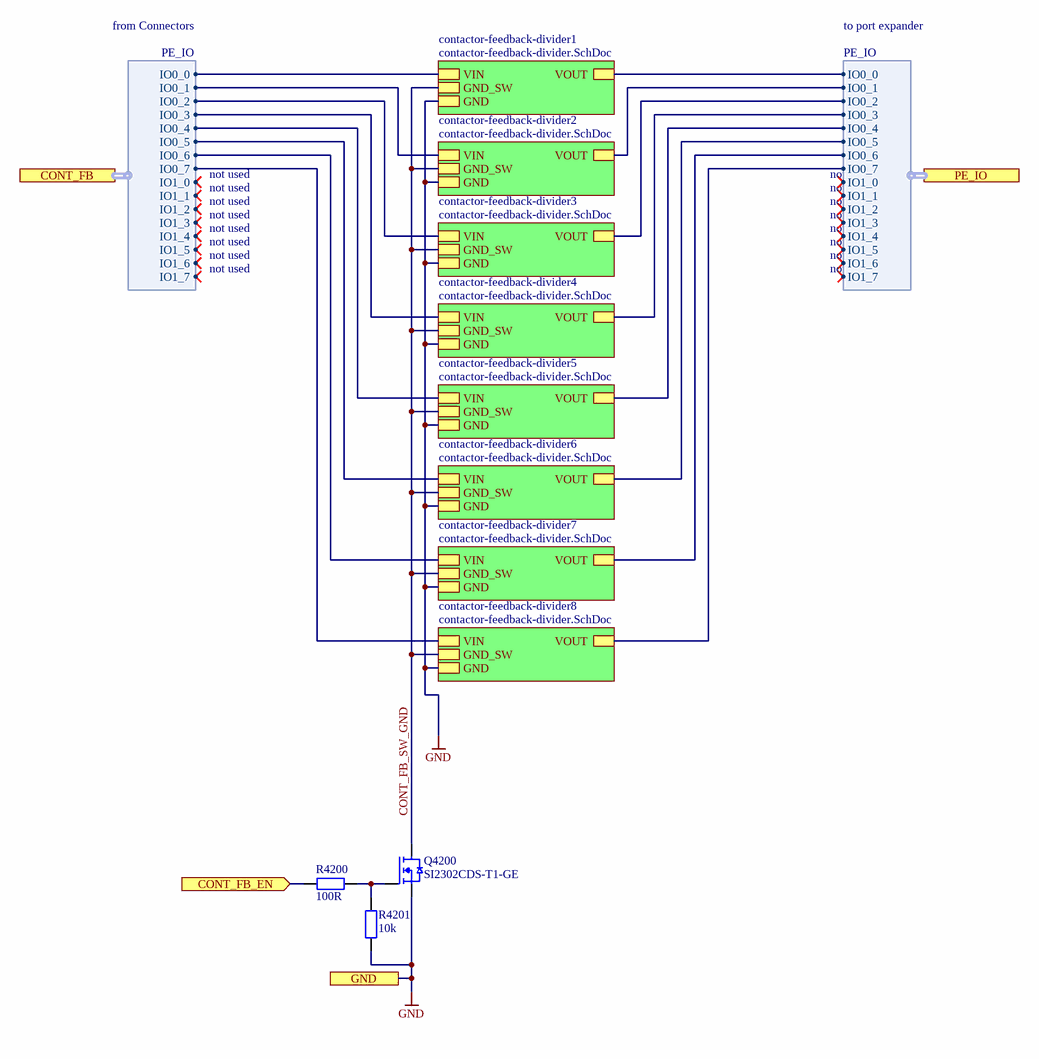
[diagram p34: contactor-feedback.SchDoc]

### Parts
Q4200  SI2302CDS-T1-GE  [SOT95P237X112-3N]
R4200  100R  [RESC1005X04N]
R4201  10k  [RESC1005X04N]

### Sub-sheets
contactor-feedback-divider1 = contactor-feedback-divider.SchDoc: GND, VOUT, VIN, GND_SW
contactor-feedback-divider2 = contactor-feedback-divider.SchDoc: GND, VOUT, VIN, GND_SW
contactor-feedback-divider3 = contactor-feedback-divider.SchDoc: GND, VOUT, VIN, GND_SW
contactor-feedback-divider4 = contactor-feedback-divider.SchDoc: GND, VOUT, VIN, GND_SW
contactor-feedback-divider5 = contactor-feedback-divider.SchDoc: GND, VOUT, VIN, GND_SW
contactor-feedback-divider6 = contactor-feedback-divider.SchDoc: GND, VOUT, VIN, GND_SW
contactor-feedback-divider7 = contactor-feedback-divider.SchDoc: GND, VOUT, VIN, GND_SW
contactor-feedback-divider8 = contactor-feedback-divider.SchDoc: GND, VOUT, VIN, GND_SW

### Ports
CONT_FB (harness PE_IO), CONT_FB_EN (in), GND, PE_IO (harness PE_IO)

### Harnesses
PE_IO: IO0_0, IO0_1, IO0_2, IO0_3, IO0_4, IO0_5, IO0_6, IO0_7, IO1_0, IO1_1, IO1_2, IO1_3, IO1_4, IO1_5, IO1_6, IO1_7

### Nets
CONT_FB_SW_GND: Q4200.D ; sheet contactor-feedback-divider1/GND_SW, sheet contactor-feedback-divider2/GND_SW, sheet contactor-feedback-divider3/GND_SW, sheet contactor-feedback-divider4/GND_SW, sheet contactor-feedback-divider5/GND_SW, sheet contactor-feedback-divider6/GND_SW, sheet contactor-feedback-divider7/GND_SW, sheet contactor-feedback-divider8/GND_SW  [project net GND_SW]
GND: Q4200.S R4201.1 ; port GND, sheet contactor-feedback-divider1/GND, sheet contactor-feedback-divider2/GND, sheet contactor-feedback-divider3/GND, sheet contactor-feedback-divider4/GND, sheet contactor-feedback-divider5/GND, sheet contactor-feedback-divider6/GND, sheet contactor-feedback-divider7/GND, sheet contactor-feedback-divider8/GND
CONT_FB.IO0_0: sheet contactor-feedback-divider1/VIN, port CONT_FB.IO0_0
CONT_FB.IO0_1: sheet contactor-feedback-divider2/VIN, port CONT_FB.IO0_1
CONT_FB.IO0_2: sheet contactor-feedback-divider3/VIN, port CONT_FB.IO0_2
CONT_FB.IO0_3: sheet contactor-feedback-divider4/VIN, port CONT_FB.IO0_3
CONT_FB.IO0_4: sheet contactor-feedback-divider5/VIN, port CONT_FB.IO0_4
CONT_FB.IO0_5: sheet contactor-feedback-divider6/VIN, port CONT_FB.IO0_5
CONT_FB.IO0_6: sheet contactor-feedback-divider7/VIN, port CONT_FB.IO0_6
CONT_FB.IO0_7: sheet contactor-feedback-divider8/VIN, port CONT_FB.IO0_7
CONT_FB_IO.IO0_0: sheet contactor-feedback-divider1/VOUT, port PE_IO.IO0_0
CONT_FB_IO.IO0_1: sheet contactor-feedback-divider2/VOUT, port PE_IO.IO0_1
CONT_FB_IO.IO0_2: sheet contactor-feedback-divider3/VOUT, port PE_IO.IO0_2
CONT_FB_IO.IO0_3: sheet contactor-feedback-divider4/VOUT, port PE_IO.IO0_3
CONT_FB_IO.IO0_4: sheet contactor-feedback-divider5/VOUT, port PE_IO.IO0_4
CONT_FB_IO.IO0_5: sheet contactor-feedback-divider6/VOUT, port PE_IO.IO0_5
CONT_FB_IO.IO0_6: sheet contactor-feedback-divider7/VOUT, port PE_IO.IO0_6
CONT_FB_IO.IO0_7: sheet contactor-feedback-divider8/VOUT, port PE_IO.IO0_7
IODEV_IO.CONT_FB_EN: R4200.1 ; port CONT_FB_EN
NetQ4200_G: Q4200.G R4200.2 R4201.2

### Notes on the sheet
- from Connectors
- to port expander
- not used
- Fraunhofer IISB
- Schottkystr. 10
- developed by:
- 91058 Erlangen
- Germany
- Author
- Project
- License
- Description
- File
- Version
- Release Date
- Sheet
- foxbms.org <https://foxbms.org>
- www.iisb.fraunhofer.de <https://www.iisb.fraunhofer.de/>
- foxBMS Team
- /

### Library data of the parts
Q4200 = SI2302CDS-T1-GE: MOSFET, N CHANNEL, 20V, 0.045OHM, 2.6A, TO-236; Manufacturer: Vishay; Maximum Continous Drain Current (25°C): 2.9A; R_DS(on): 60m; Total Gate Charge: 3.5nC; Automotive Qualified: False; Part Number: SI2302CDS-T1-GE; Part Name: NMOS; Operating Temperature: -55°C - +150°C; Maximum Drain-Source Voltage: 20V; ComponentLink1Description: Datasheet; ComponentLink1URL: http://www.farnell.com/datasheets/2046484.pdf?_ga=2.69037521.1386499687.1551691751-810718100.1550587845; Supplier 1: Farnell; Supplier Part Number 1: 2524651; Supplier 2: Mouser; Supplier Part Number 2: 781-SI2302CDS-E3; Supplier 3: Digikey; Supplier Part Number 3: SI2302CDS-T1-E3CT-ND
R4200 = gen_R_100R_0402: as R6407 on sheet rtc; Part Number: gen_R_100R_0402; Operating Temperature: -55°C - +155°C; Resistance: 100R; Series: E24, E96; PnP Value: 100R; Supplier 1: Farnell; Supplier Part Number 1: 2302528; ECCN: EAR99
R4201 = gen_R_10k_0402: as R6400 on sheet rtc; Part Number: gen_R_10k_0402; Operating Temperature: -55°C - +155°C; Resistance: 10k; Series: E24, E96; PnP Value: 10k; Supplier 1: Farnell; Supplier Part Number 1: 2059239; ECCN: EAR99

## Sheet contactor-feedback-divider.SchDoc
size A3; DocumentNumber: 17; SheetNumber: 17; SheetTotal: 45; SheetDescription: Contactor Feedback Resistor Divider
Used 8 times, as channels io-devices/contactor-feedback/contactor-feedback-divider1, io-devices/contactor-feedback/contactor-feedback-divider2, io-devices/contactor-feedback/contactor-feedback-divider3, io-devices/contactor-feedback/contactor-feedback-divider4, io-devices/contactor-feedback/contactor-feedback-divider5, io-devices/contactor-feedback/contactor-feedback-divider6, io-devices/contactor-feedback/contactor-feedback-divider7, io-devices/contactor-feedback/contactor-feedback-divider8. Parts and nets are listed once, with the designators drawn on the sheet.
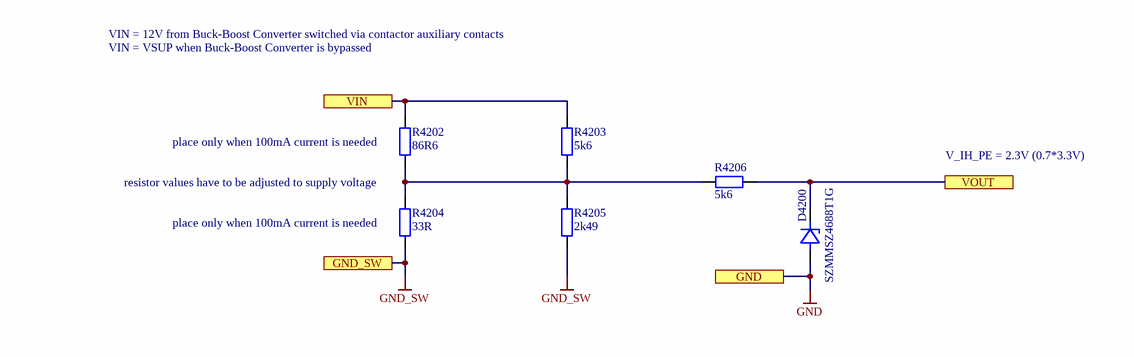
[diagram p35: contactor-feedback-divider.SchDoc]

### Parts
D4200  SZMMSZ4688T1G  [SOD-123_CASE-425-04-ISSUE-G]
R4202  86R6  [RESC5025X07N]
R4203  5k6  [RESC1005X04N]
R4204  33R  [RESC5025X07N]
R4205  2k49  [RESC1005X04N]
R4206  5k6  [RESC1005X04N]

### Ports
GND, GND_SW, VIN, VOUT

### Nets
GND: D4200.2(A) ; port GND
GND_SW: R4204.1 R4205.1 ; port GND_SW
VIN: R4202.2 R4203.2 ; port VIN
VOUT: D4200.1(K) R4206.1 ; port VOUT
NetR4202_1: R4202.1 R4203.1 R4204.2 R4205.2 R4206.2

### Channels
io-devices/contactor-feedback/contactor-feedback-divider1: designators end in _1; ports GND=GND GND_SW=GND_SW VIN=CONT_FB.IO0_0 VOUT=CONT_FB_IO.IO0_0
io-devices/contactor-feedback/contactor-feedback-divider2: designators end in _2; ports GND=GND GND_SW=GND_SW VIN=CONT_FB.IO0_1 VOUT=CONT_FB_IO.IO0_1
io-devices/contactor-feedback/contactor-feedback-divider3: designators end in _3; ports GND=GND GND_SW=GND_SW VIN=CONT_FB.IO0_2 VOUT=CONT_FB_IO.IO0_2
io-devices/contactor-feedback/contactor-feedback-divider4: designators end in _4; ports GND=GND GND_SW=GND_SW VIN=CONT_FB.IO0_3 VOUT=CONT_FB_IO.IO0_3
io-devices/contactor-feedback/contactor-feedback-divider5: designators end in _5; ports GND=GND GND_SW=GND_SW VIN=CONT_FB.IO0_4 VOUT=CONT_FB_IO.IO0_4
io-devices/contactor-feedback/contactor-feedback-divider6: designators end in _6; ports GND=GND GND_SW=GND_SW VIN=CONT_FB.IO0_5 VOUT=CONT_FB_IO.IO0_5
io-devices/contactor-feedback/contactor-feedback-divider7: designators end in _7; ports GND=GND GND_SW=GND_SW VIN=CONT_FB.IO0_6 VOUT=CONT_FB_IO.IO0_6
io-devices/contactor-feedback/contactor-feedback-divider8: designators end in _8; ports GND=GND GND_SW=GND_SW VIN=CONT_FB.IO0_7 VOUT=CONT_FB_IO.IO0_7

### Notes on the sheet
- VIN = 12V from Buck-Boost Converter switched via contactor auxiliary contacts
- VIN = VSUP when Buck-Boost Converter is bypassed
- (near R4202) place only when 100mA current is needed
- resistor values have to be adjusted to supply voltage
- V_IH_PE = 2.3V (0.7*3.3V)
- (near R4204) place only when 100mA current is needed
- Fraunhofer IISB
- Schottkystr. 10
- developed by:
- 91058 Erlangen
- Germany
- Author
- Project
- License
- Description
- File
- Version
- Release Date
- Sheet
- foxbms.org <https://foxbms.org>
- www.iisb.fraunhofer.de <https://www.iisb.fraunhofer.de/>
- foxBMS Team
- /

### Library data of the parts
D4200 = SZMMSZ4688T1G: as D6400 on sheet rtc; Part Number: SZMMSZ4688T1G; Part Name: SZMMSZ4688T1G; Operating Temperature: -55°C - +150°C; ComponentLink1Description: Datasheet; ComponentLink1URL: https://www.onsemi.com/pub/Collateral/MMSZ4678T1-D.PDF; Supplier 1: Digikey; Supplier Part Number 1: SZMMSZ4688T1GOSCT-ND; Supplier 2: Farnell; Supplier Part Number 2: 2774579; Supplier 3: Mouser; Supplier Part Number 3: 863-SZMMSZ4688T1G
R4202 = gen_R_86R6_2010: SMD Resistor 86R6 2010; Tolerance: 1%; Power: 0.75W; Case EIA: 2010; Case Metric: 5025; Maximum Working Voltage: 400V; PnP Package: 2010R; Automotive Qualified: True; AEC-Q Grade: Grade 0; AEC-Q Norm: AEC-Q200; Part Number: gen_R_86R6_2010; Operating Temperature: -55°C - +155°C; Resistance: 86R6; Series: E96; PnP Value: 86R6; ECCN: EAR99; Supplier 1: Digikey; Supplier Part Number 1: 541-86.6ACCT-ND
R4203 R4206 = gen_R_5k6_0402: SMD Resistor 5k6 0402; Tolerance: 1%; Power: 0.063W; Case EIA: 0402; Case Metric: 1005; Maximum Working Voltage: 50V; PnP Package: 0402R; Automotive Qualified: True; AEC-Q Grade: Grade 0; AEC-Q Norm: AEC-Q200; Part Number: gen_R_5k6_0402; Operating Temperature: -55°C - +155°C; Resistance: 5k6; Series: E24; PnP Value: 5k6; ECCN: EAR99; Supplier 1: Digikey; Supplier Part Number 1: A129636CT-ND
R4204 = gen_R_33R_2010: SMD Resistor 33R 2010; Tolerance: 1%; Power: 0.75W; Case EIA: 2010; Case Metric: 5025; Maximum Working Voltage: 400V; PnP Package: 2010R; Automotive Qualified: True; AEC-Q Grade: Grade 0; AEC-Q Norm: AEC-Q200; Part Number: gen_R_33R_2010; Operating Temperature: -55°C - +155°C; Resistance: 33R; Series: E24; PnP Value: 33R; ECCN: EAR99; Supplier 1: Farnell; Supplier Part Number 1: 2324408
R4205 = gen_R_2k49_0402: as R6403 on sheet rtc; Part Number: gen_R_2k49_0402; Operating Temperature: -55°C - +155°C; Resistance: 2k49; Series: E96; PnP Value: 2k49; Supplier 1: Farnell; Supplier Part Number 1: 2059135

## Sheet insulation-monitoring.SchDoc
size A3; DocumentNumber: 18; SheetNumber: 18; SheetTotal: 45; SheetDescription: Insulation Monitoring Interface
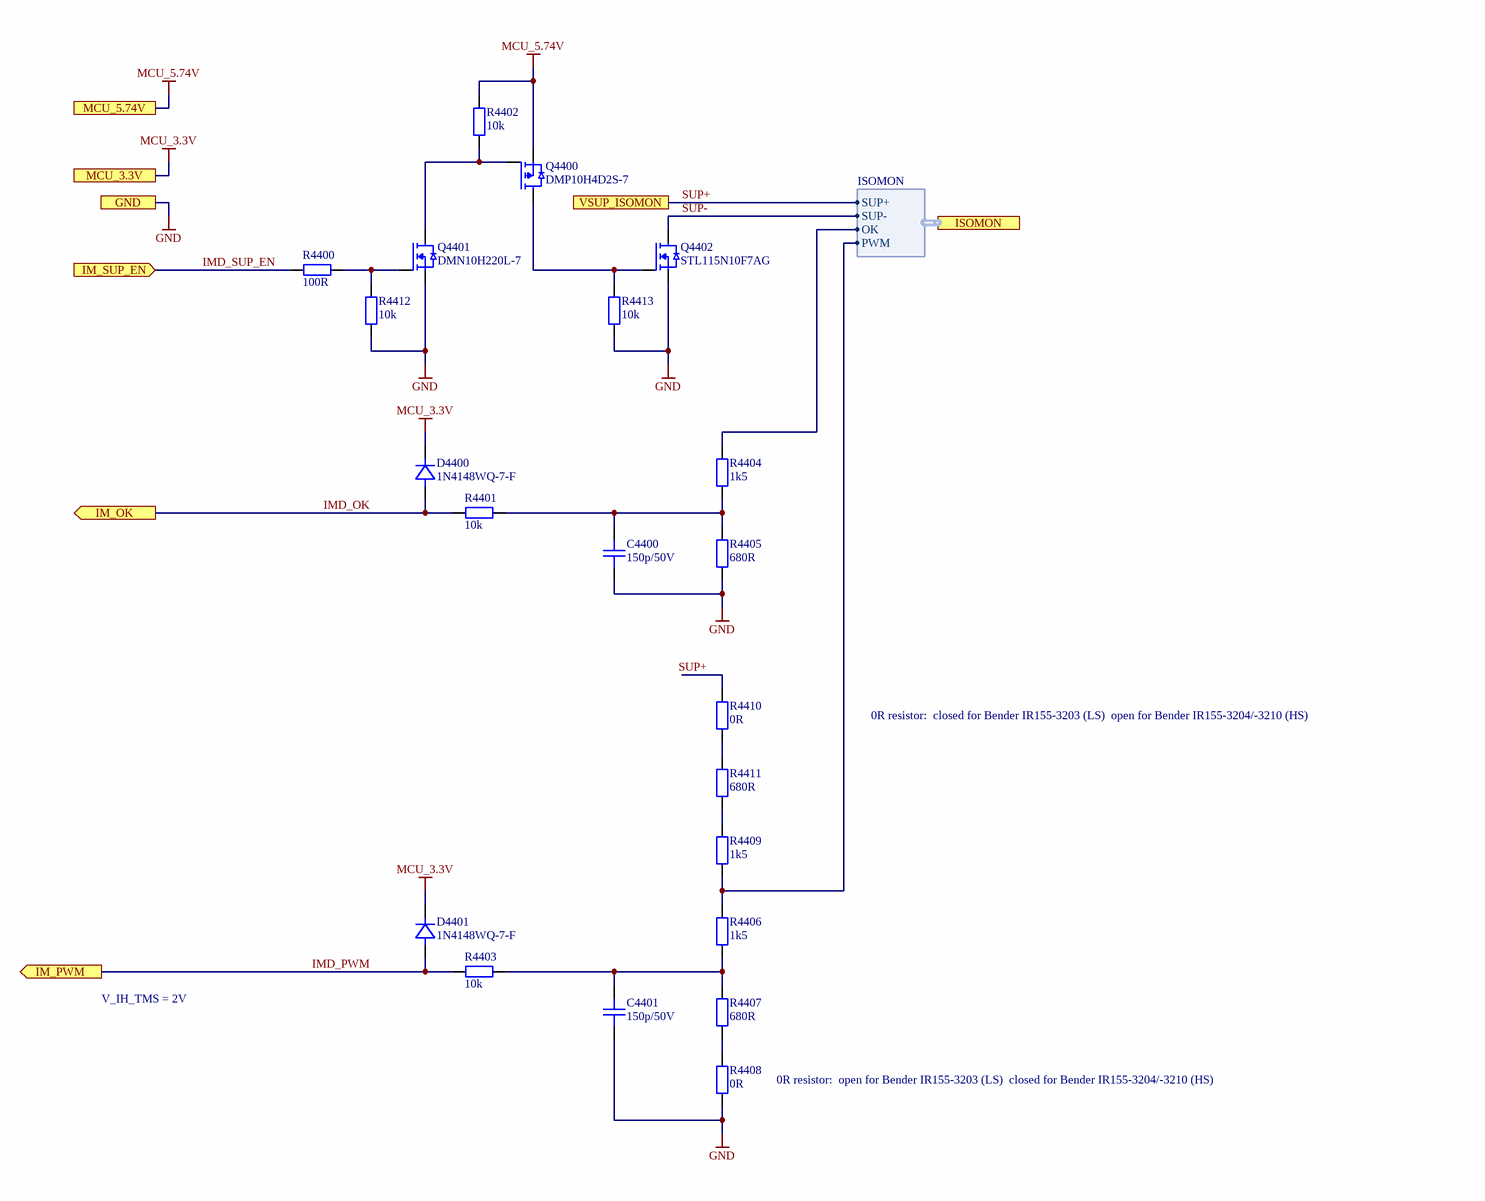
[diagram p36: insulation-monitoring.SchDoc]

### Parts
C4400  150p/50V  [CAPC1005X06N]
C4401  150p/50V  [CAPC1005X06N]
D4400  1N4148WQ-7-F  [SOD-123_CASE-425-04-ISSUE-G]
D4401  1N4148WQ-7-F  [SOD-123_CASE-425-04-ISSUE-G]
Q4400  DMP10H4D2S-7  [SOT95P237X110-3N]
Q4401  DMN10H220L-7  [SOT95P237X110-3N]
Q4402  STL115N10F7AG  [ST_PowerFLAT_5x6_WF_type_C]
R4400  100R  [RESC1005X04N]
R4401  10k  [RESC1005X04N]
R4402  10k  [RESC1005X04N]
R4403  10k  [RESC1005X04N]
R4404  1k5  [RESC1005X04N]
R4405  680R  [RESC1005X04N]
R4406  1k5  [RESC1005X04N]
R4407  680R  [RESC1005X04N]
R4408  0R  [RESC1005X04N]
R4409  1k5  [RESC1005X04N]
R4410  0R  [RESC1005X04N]
R4411  680R  [RESC1005X04N]
R4412  10k  [RESC1005X04N]
R4413  10k  [RESC1005X04N]

### Ports
GND, IM_OK (out), IM_PWM (out), IM_SUP_EN (in), ISOMON (harness ISOMON), MCU_3.3V, MCU_5.74V, VSUP_ISOMON

### Harnesses
ISOMON: SUP+, SUP-, OK, PWM

### Nets
GND: C4400.1 C4401.1 Q4401.S Q4402.S R4405.1 R4408.1 R4412.1 R4413.1 ; port GND
MCU_3.3V: D4400.1(K) D4401.1(K) ; port MCU_3.3V
MCU_5.74V: Q4400.S R4402.2 ; port MCU_5.74V
SUP+: R4410.2 ; port VSUP_ISOMON, port ISOMON.SUP+  [project net VBB_12V]
IMD_OK: D4400.2(A) R4401.2 ; port IM_OK  [project net IODEV_IO.IM_OK]
IMD_PWM: D4401.2(A) R4403.2 ; port IM_PWM  [project net IODEV_IO.IM_PWM]
IMD_SUP_EN: R4400.1 ; port IM_SUP_EN  [project net IODEV_IO.IM_SUP_EN]
ISOMON.OK: R4404.2 ; port ISOMON.OK
ISOMON.PWM: R4406.2 R4409.1 ; port ISOMON.PWM
SUP-: Q4402.D ; port ISOMON.SUP-  [project net ISOMON.SUP-]
NetC4400_2: C4400.2 R4401.1 R4404.1 R4405.2
NetC4401_2: C4401.2 R4403.1 R4406.1 R4407.2
NetQ4400_D: Q4400.D Q4402.G R4413.2
NetQ4400_G: Q4400.G Q4401.D R4402.1
NetQ4401_G: Q4401.G R4400.2 R4412.2
NetR4407_1: R4407.1 R4408.2
NetR4409_2: R4409.2 R4411.2
NetR4410_1: R4410.1 R4411.1

### Notes on the sheet
- 0R resistor:
  closed for Bender IR155-3203 (LS)
  open for Bender IR155-3204/-3210 (HS)
- V_IH_TMS = 2V
- 0R resistor:
  open for Bender IR155-3203 (LS)
  closed for Bender IR155-3204/-3210 (HS)
- Fraunhofer IISB
- Schottkystr. 10
- developed by:
- 91058 Erlangen
- Germany
- Author
- Project
- License
- Description
- File
- Version
- Release Date
- Sheet
- foxbms.org <https://foxbms.org>
- www.iisb.fraunhofer.de <https://www.iisb.fraunhofer.de/>
- foxBMS Team
- /

### Library data of the parts
C4400 C4401 = gen_C_ceramic_150p_50V_C0G_0402: MLCC; Capacitance: 150p; Rated Voltage: 50V; Dielectric: C0G; Case EIA: 0402; Case Metric: 1005; Automotive Qualified: True; PnP Package: 0402C; Part Number: gen_C_ceramic_150p_50V_C0G_0402; Supplier 1: Digikey; Supplier Part Number 1: 490-4926-1-ND
D4400 D4401 = 1N4148WQ-7-F: Diode; Manufacturer: Diodes Inc.; Breakdown Voltage: 100V; Continuous Forward Current: 300mA; PnP Package: SOD123; Automotive Qualified: True; Part Number: 1N4148WQ-7-F; Part Name: 1N4148WQ-7-F; Operating Temperature: -65°C - +150°C; ComponentLink1Description: Datasheet; ComponentLink1URL: https://www.diodes.com/assets/Datasheets/ds30086.pdf; Supplier 1: Digikey; Supplier Part Number 1: 1N4148WQ-7-FDICT-ND
Q4400 = DMP10H4D2S-7: as Q6400 on sheet rtc; Part Number: DMP10H4D2S-7; Part Name: PMOS; Operating Temperature: -55°C - +150°C; ComponentLink1Description: Datasheet; ComponentLink1URL: https://www.diodes.com/assets/Datasheets/DMP10H4D2S.pdf; Supplier 1: Farnell; Supplier Part Number 1: 3127354; Supplier 2: Digikey; Supplier Part Number 2: DMP10H4D2S-7DICT-ND; Supplier 3: Mouser; Supplier Part Number 3: 621-DMP10H4D2S-7
Q4401 = DMN10H220L-7: as Q6402 on sheet rtc; Part Number: DMN10H220L-7; Part Name: NMOS; Operating Temperature: -55°C - +150°C; ComponentLink1Description: Datasheet; ComponentLink1URL: https://www.diodes.com/assets/Datasheets/DMN10H220L.pdf; Supplier 1: Digikey; Supplier Part Number 1: DMN10H220L-7DICT-ND; Supplier 2: Farnell; Supplier 3: Mouser; Supplier Part Number 2: 3127326; Supplier Part Number 3: 621-DMN10H220L-7
Q4402 = STL115N10F7AG: N-Channel MOSFET, 100 V, 107 A, 5 mOhm; Manufacturer: STMicroelectronics; Maximum Drain-Source Voltage: 100V; Maximum Continous Drain Current (25°C): 107A; R_DS(on): 5m; Total Gate Charge: 72.5nC; Automotive Qualified: True; AEC-Q Norm: AEC-Q101; AEC-Q Grade: Grade 0; Part Number: STL115N10F7AG; Part Name: NMOS; Operating Temperature: -55°C - +175°C; ComponentLink1Description: Datasheet; ComponentLink1URL: https://www.mouser.de/datasheet/2/389/dm00333356-1798814.pdf; Supplier 1: Mouser; Supplier Part Number 1: 511-STL115N10F7AG; Supplier 2: Digikey; Supplier Part Number 2: 497-17622-1-ND; ECCN: EAR99
R4400 = gen_R_100R_0402: as R6407 on sheet rtc; Part Number: gen_R_100R_0402; Operating Temperature: -55°C - +155°C; Resistance: 100R; Series: E24, E96; PnP Value: 100R; Supplier 1: Farnell; Supplier Part Number 1: 2302528; ECCN: EAR99
R4401-R4403 R4412 R4413 = gen_R_10k_0402: as R6400 on sheet rtc; Part Number: gen_R_10k_0402; Operating Temperature: -55°C - +155°C; Resistance: 10k; Series: E24, E96; PnP Value: 10k; Supplier 1: Farnell; Supplier Part Number 1: 2059239; ECCN: EAR99
R4404 R4406 R4409 = gen_R_1k5_0402: SMD Resistor 1k5 0402; Tolerance: 1%; Power: 0.063W; Case EIA: 0402; Case Metric: 1005; Maximum Working Voltage: 50V; PnP Package: 0402R; Automotive Qualified: True; Part Number: gen_R_1k5_0402; Operating Temperature: -55°C - +155°C; Resistance: 1k5; Series: E24, E96; PnP Value: 1k5; Supplier 1: Farnell; Supplier Part Number 1: 2302656; Supplier 2: Farnell; Supplier Part Number 2: 1653201
R4405 R4407 R4411 = gen_R_680R_0402: SMD Resistor 680R 0402; Tolerance: 1%; Power: 0.063W; Case EIA: 0402; Case Metric: 1005; Maximum Working Voltage: 50V; PnP Package: 0402R; Automotive Qualified: True; AEC-Q Grade: Grade 0; AEC-Q Norm: AEC-Q200; Part Number: gen_R_680R_0402; Operating Temperature: -55°C - +155°C; Resistance: 680R; Series: E24; PnP Value: 680R; ECCN: EAR99; Supplier 1: Farnell; Supplier Part Number 1: 2302619
R4408 R4410 = gen_R_0R_0402: SMD Resistor 0R 0402; Power: 0.063W; Case EIA: 0402; Case Metric: 1005; PnP Package: 0402R; Maximum Working Voltage: 50V; Automotive Qualified: True; AEC-Q Norm: AEC-Q200; PnP equipped: x; Part Number: gen_R_0R_0402; Operating Temperature: -55°C - +155°C; Resistance: 0R; Series: Jumper; PnP Value: 0R; Supplier 1: Farnell; Supplier Part Number 1: 1469661; Supplier 2: Farnell; Supplier Part Number 2: 2059190; ECCN: EAR99